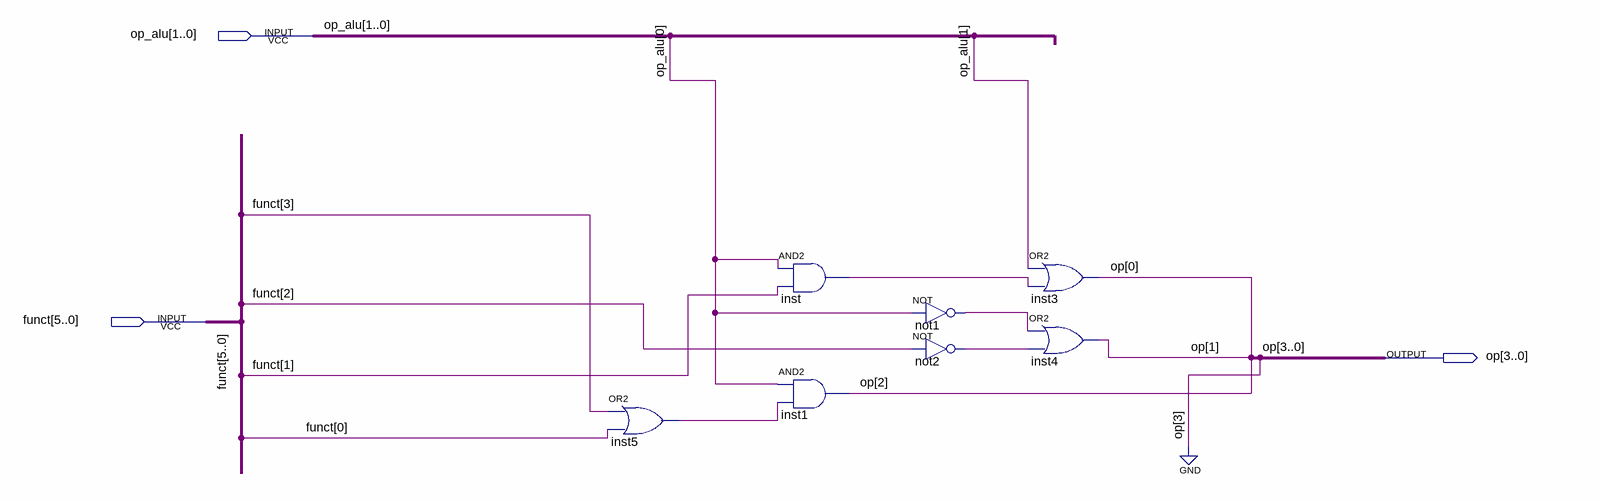
[diagram p0: schematic sheet]
// Quartus schematic alu_control_logic.bdf as structural Verilog: 7 symbols, 3 pins
module alu_control_logic (
  input  [1:0] op_alu,
  input  [5:0] funct,
  output [3:0] op
);

  wire inst5_out, inst_out, not1_out, not2_out;

  or inst5 (inst5_out, funct[3], funct[0]);
  and inst (inst_out, op_alu[0], funct[1]);
  and inst1 (op[2], op_alu[0], inst5_out);
  not not1 (not1_out, op_alu[0]);
  not not2 (not2_out, funct[2]);
  or inst3 (op[0], op_alu[1], inst_out);
  or inst4 (op[1], not1_out, not2_out);

  assign op[3] = 1'b0;
endmodule
